# EasyEDA Pro project ThermistorFlex.eprj

# Schematic Schematic1
Board Name: Board1; Create Date: 2025-08-02; Page Name: P1; Project Name: ThermistorFlex; Schematic Name: Schematic1; Update Date: 2025-08-02; Company: EasyEDA.com; Page Size: A4; Version: V1.0
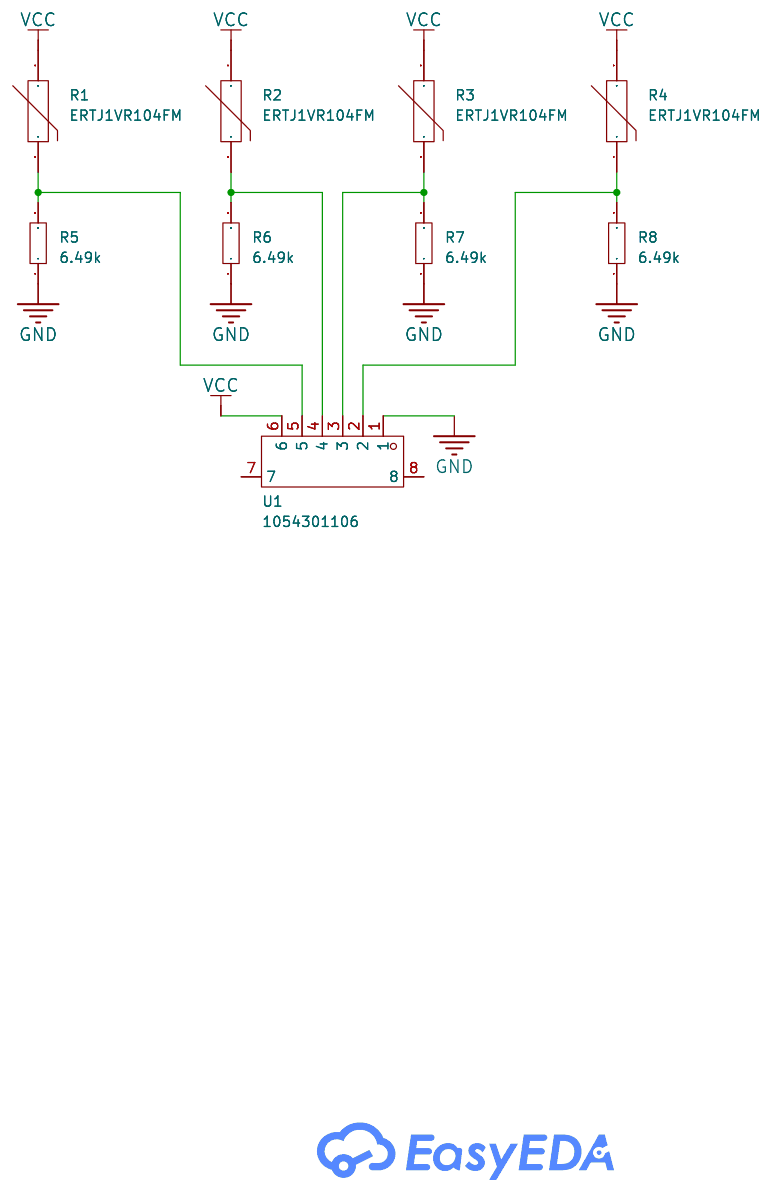
[diagram p0: schematic sheet]

## Parts
R1  ERTJ1VR104FM  [R0603]
R2  ERTJ1VR104FM  [R0603]
R3  ERTJ1VR104FM  [R0603]
R4  ERTJ1VR104FM  [R0603]
R5  6.49k  [R0603]
R6  6.49k  [R0603]
R7  6.49k  [R0603]
R8  6.49k  [R0603]
U1  1054301106  [CONN-SMD_6P-P2.50_1054301106]

## Library data of the parts
R1-R4 = ERTJ1VR104FM: Supplier Part: C336557; Manufacturer: PANASONIC(松下); Supplier Footprint: 0603; JLCPCB Part Class: Extended Part; Datasheet: https://atta.szlcsc.com/upload/public/pdf/source/20190215/C336557_EE8DBAAEED16D9BC11EE4695D1B22AA5.pdf; Supplier: LCSC; B Constant (25℃/85℃): 4250K; Operating Temperature: -40℃~+150℃
R5-R8 = Res_0603: Supplier Footprint: 0603
U1 = 1054301106: Supplier Part: C5350173; Supplier Footprint: SMD,P=2.5mm; JLCPCB Part Class: Extended Part; Supplier: LCSC

## Nets
GND: R5.1 R6.1 R7.1 R8.1 U1.1
VCC: R1.2 R2.2 R3.2 R4.2 U1.6
$1N663: R1.1 R5.2 U1.5
$1N682: R2.1 R6.2 U1.4
$1N698: R3.1 R7.2 U1.3
$1N714: R4.1 R8.2 U1.2

Not connected (* = marked no-connect by the designer): U1 7 8

# Board PCB1
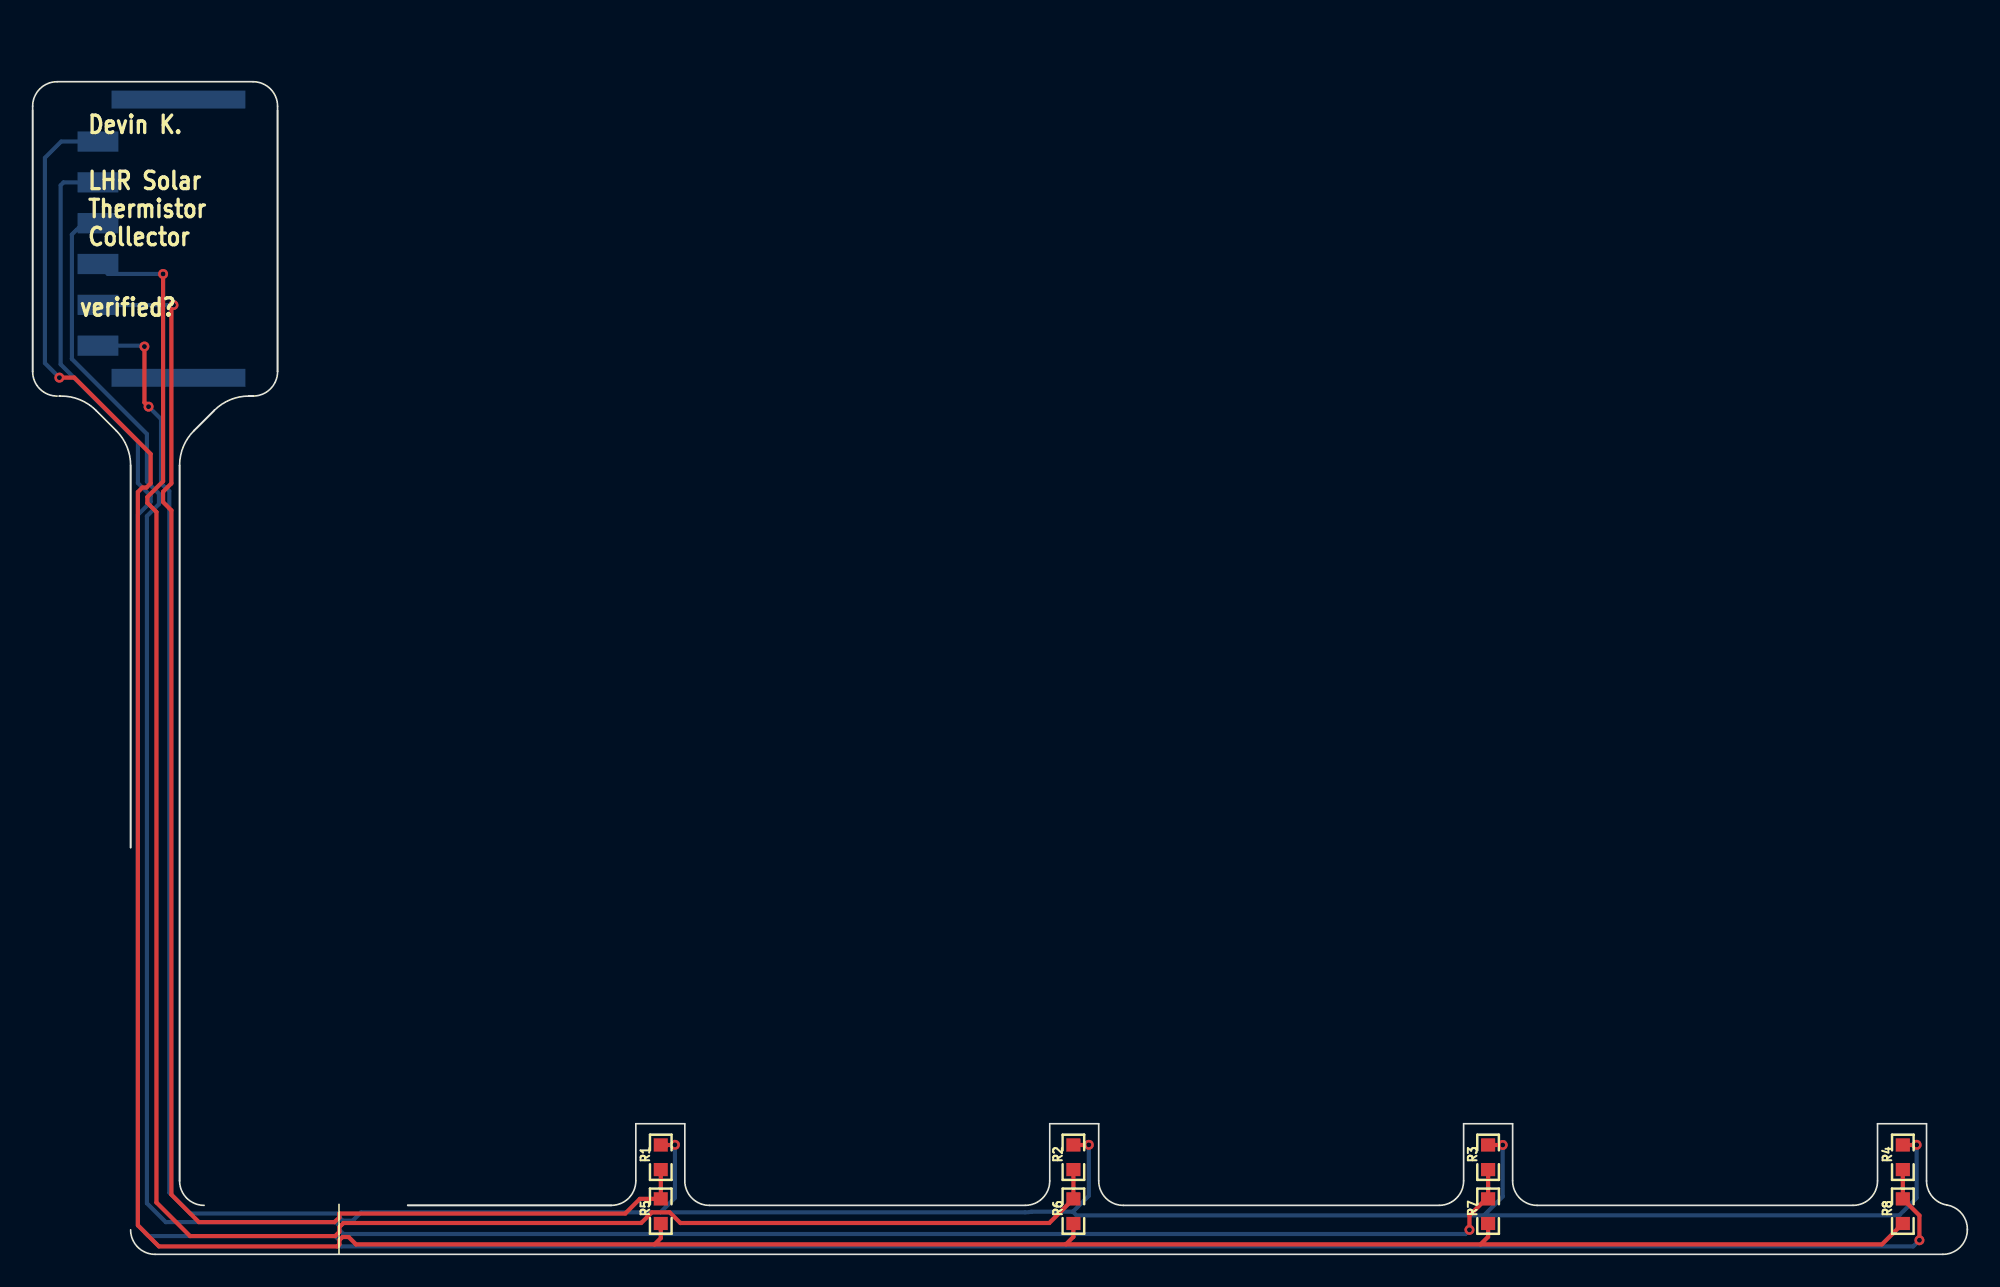
[diagram p1: board, top side]
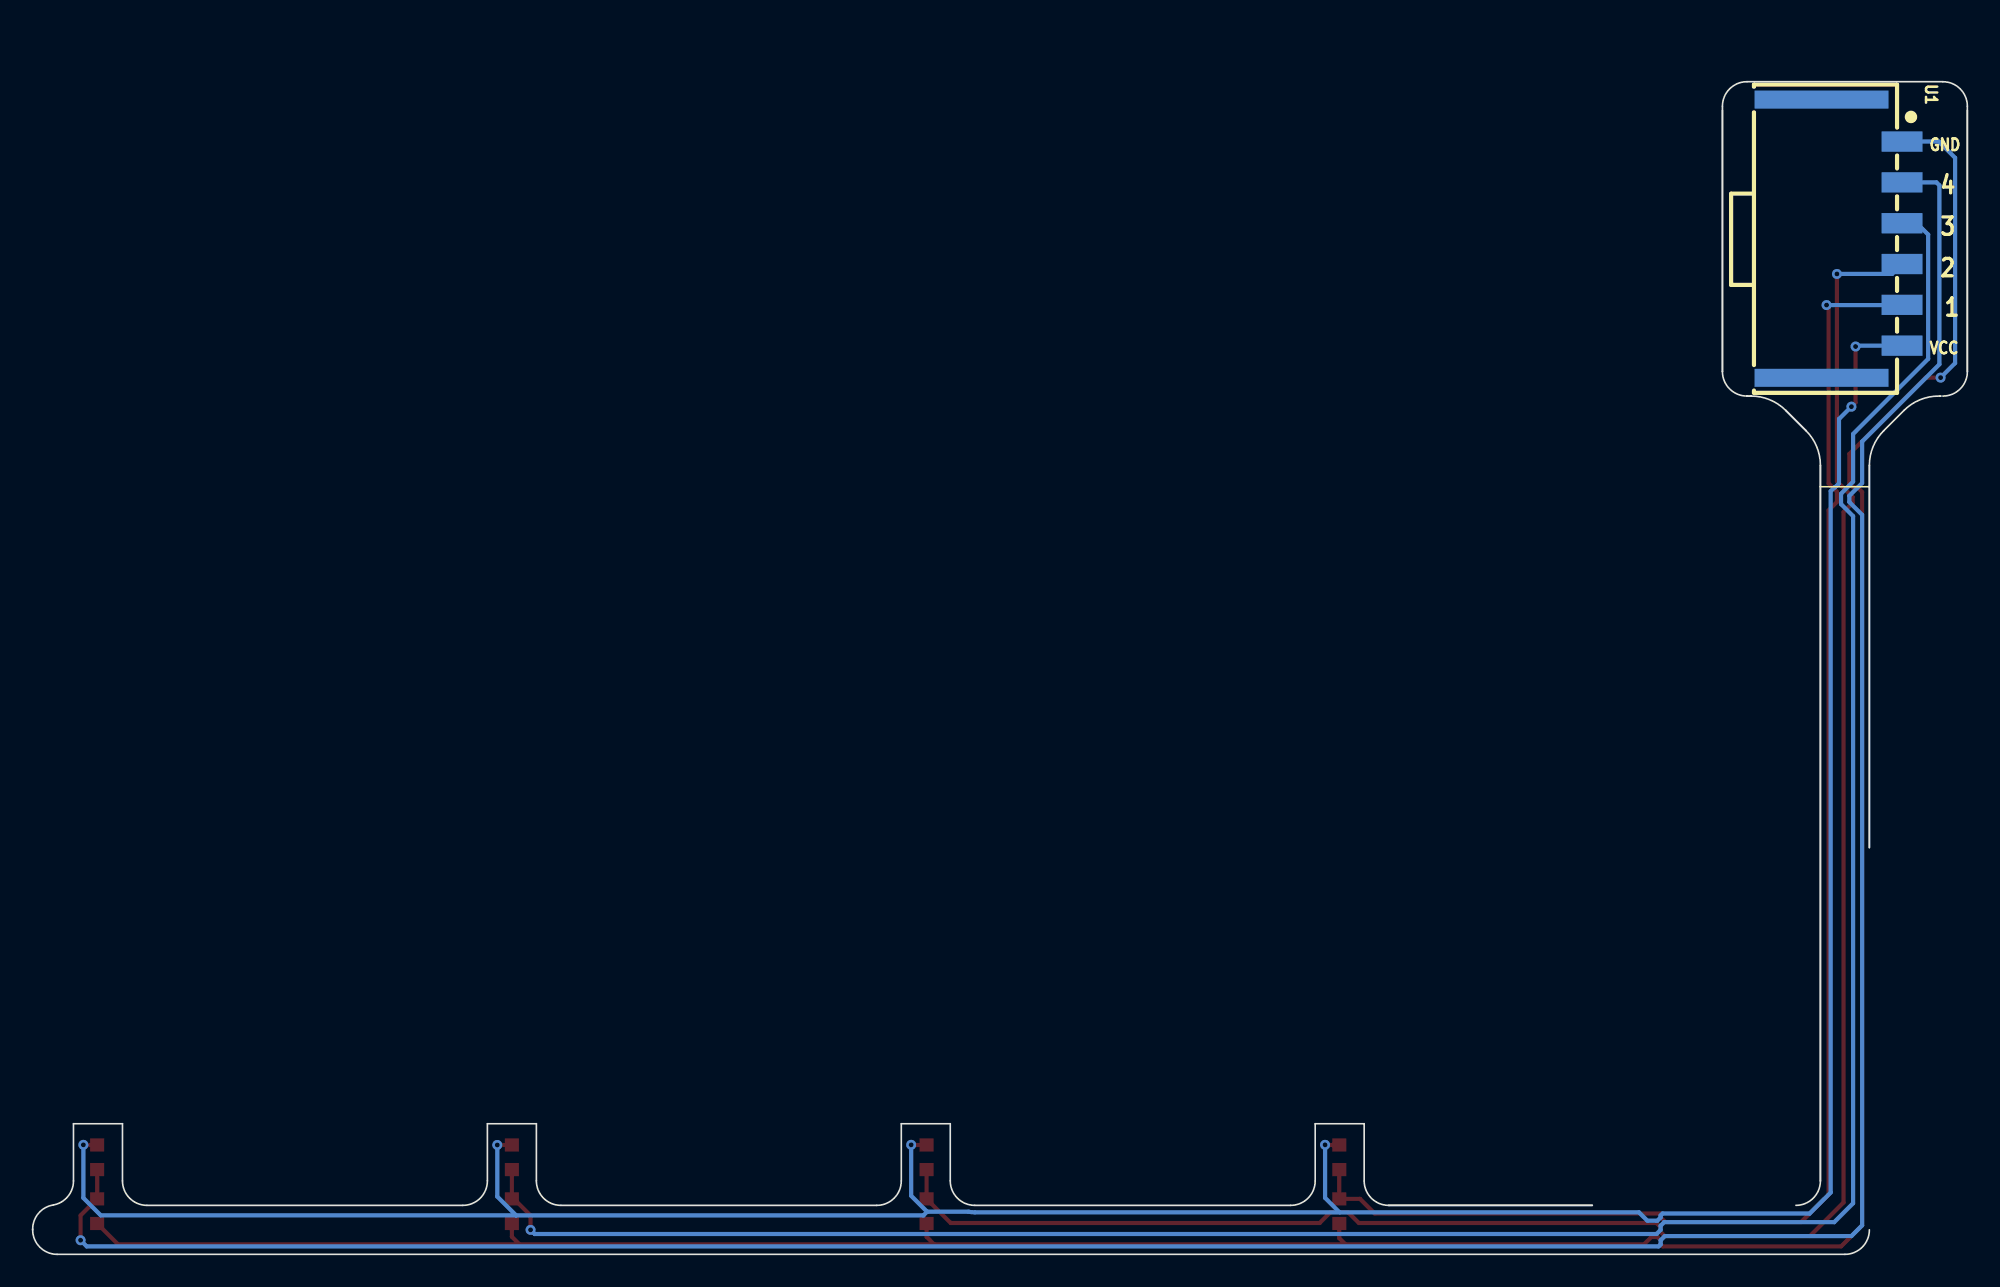
[diagram p2: board, bottom side, seen from below]

Outline 118.49 x 71.82 mm; copper layers: Top Layer, Bottom Layer. Coordinates in mm from the lower left corner of the outline.
Outline path: 0,70.07 0,54.07 ; 0,54.07 0,70.32 arc(0.44,71.38) 1.5,71.82 13.5,71.82 arc(14.56,71.38) 15,70.32 15,54.07 ; 0,54.07 arc(0.44,53.01) 1.5,52.57 ; 1.76,52.57 arc(2.91,52.34) 3.88,51.69 5.12,50.45 arc(5.77,49.47) 6,48.32 ; 6,48.32 6,24.91 6,48.32 ; 6,1.5 arc(6.44,0.44) 7.5,0 116.99,0 arc(118.05,0.44) 118.49,1.5 118.49,1.54 arc(118.14,2.51) 117.24,3.02 arc(116.35,3.53) 115.99,4.5 115.99,8 112.99,8 112.99,4.5 arc(112.55,3.44) 111.49,3 92.14,3 arc(91.08,3.44) 90.64,4.5 90.64,8 87.64,8 87.64,4.5 arc(87.2,3.44) 86.14,3 66.79,3 arc(65.73,3.44) 65.29,4.5 65.29,8 62.29,8 62.29,4.5 arc(61.85,3.44) 60.79,3 41.44,3 arc(40.38,3.44) 39.94,4.5 39.94,8 36.94,8 36.94,4.5 arc(36.5,3.44) 35.44,3 ; 9,48.32 9,4.5 ; 9,48.32 arc(9.23,49.47) 9.88,50.45 ; 9,48.32 9,4.5 ; 9,4.5 arc(9.44,3.44) 10.5,3 ; 9.88,50.45 11.12,51.69 ; 9.88,50.45 11.12,51.69 ; 11.12,51.69 arc(12.09,52.34) 13.24,52.57 ; 13.24,52.57 13.5,52.57 ; 13.24,52.57 13.5,52.57 ; 13.5,52.57 arc(14.56,53.01) 15,54.07 ; 15,54.07 15,70.07 ; 35.44,3 22.97,3 35.44,3 ; 1.63,52.57 1.69,52.57 1.63,52.57
Stack: Top Layer 0.012mm / Dielectric1 0.025mm FR4 er 4.5 / Bottom Layer 0.012mm

## Design rules (mm)
template: JLCPCB Capability(Two Layers Board)
spacing copperThickness1oz (default): track to track 0.102, other pairs 0.152 to 0.3
spacing copperThickness2oz: track to track 0.203, other pairs 0.152 to 0.3
track width copperThickness1oz (default): min 0.127, default 0.254, max 2.54
track width copperThickness2oz: min 0.203, default 0.254, max 2.54
differential pair differentialPair (default): width min 0.127, default 0.254, max 2.54; gap min 0.152, default 0.152
via viaSize (default): diameter min 0.5, default 0.61, max 10; hole min 0.3, default 0.305, max 6.3

## Placement (name value [footprint] x y rotation side)
R1  ERTJ1VR104FM  [R0603]  38.47 5.94 90 top
R2  ERTJ1VR104FM  [R0603]  63.74 5.94 90 top
R3  ERTJ1VR104FM  [R0603]  89.14 5.94 90 top
R4  ERTJ1VR104FM  [R0603]  114.54 5.94 90 top
R5  6.49k  [R0603]  38.47 2.64 90 top
R6  6.49k  [R0603]  63.74 2.64 90 top
R7  6.49k  [R0603]  89.14 2.64 90 top
R8  6.49k  [R0603]  114.54 2.64 90 top
U1  1054301106  [CONN-SMD_6P-P2.50_1054301106]  6.47 62.21 270 bottom

## Footprints (pads in the part's own frame, mm; a bottom-side part is the same pattern mirrored in y, then rotated)
CONN-SMD_6P-P2.50_1054301106
  rect 1.24x2.5 smd: 1(-5.95,2.465) 2(-3.45,2.465) 3(-0.95,2.465) 4(1.55,2.465) 5(4.05,2.465) 6(6.55,2.465)
  rect 1.1x8.2 smd: 7(8.52,-2.465) 8(-8.52,-2.465)
R0603
  rect 0.806x0.864 smd: 1(-0.753,0) 2(0.753,0)

## Nets
As in the schematic.

Pads without a net: U1 7 8

## Via types
v1: diameter 0.61, hole 0.305, Top Layer to Bottom Layer, 11 vias

## Routing (per net, layer and track width the routed paths; a pad name or vN(x,y) marks a point on that pad's centre or on a via; arc(x,y) is an arc through that point)
GND: length 186.9
  Top Layer w0.254: R5.1 38.47,0.99 38.09,0.61 ; 38.09,0.61 63.28,0.61 ; 38.09,0.61 19.8,0.61 19.35,1.06 18.98,1.06 18.78,0.87 18.78,0.61 18.66,0.49 7.73,0.49 6.44,1.77 6.44,46.69 6.72,46.97 6.97,46.97 7.23,47.22 7.23,49.02 2.55,53.7 v1(1.64,53.7) ; 63.28,0.61 63.74,1.07 R6.1 ; 63.28,0.61 88.68,0.61 ; R7.1 89.14,1.07 88.68,0.61 ; R8.1 113.26,0.61 88.68,0.61
  Bottom Layer w0.254: v1(1.64,53.7) 0.75,54.59 0.75,67.16 1.75,68.16 U1.1
VCC: length 184.5
  Top Layer w0.254: v1(115.39,6.71) 115.38,6.7 R4.2 ; v1(6.85,55.6) 6.85,52.17 v1(7.1,51.92) ; R3.2 v1(90.04,6.7) ; R1.2 39.33,6.7 v1(39.34,6.71) ; v1(64.69,6.71) 64.68,6.7 R2.2
  Bottom Layer w0.254: 88.89,2.39 114.32,2.39 115.39,3.46 v1(115.39,6.71) ; 88.89,2.39 88.88,2.39 63.94,2.39 63.71,2.61 ; 88.89,2.39 90.04,3.54 v1(90.04,6.7) ; U1.6 6.79,55.66 v1(6.85,55.6) ; v1(7.1,51.92) 7.86,51.16 7.86,47.22 8.12,46.97 8.15,46.97 8.37,46.75 8.37,3.79 9.66,2.5 18.67,2.5 18.78,2.38 18.78,2.26 18.99,2.06 19.6,2.06 20.11,2.57 38.41,2.57 ; v1(64.69,6.71) 64.69,3.59 63.71,2.61 ; 63.71,2.61 61.17,2.61 arc(60.98,2.58) 60.79,2.57 38.45,2.57 39.34,3.46 v1(39.34,6.71)
$1N663: length 92.8
  Top Layer w0.254: R1.1 R5.2 37.19,3.4 36.29,2.5 18.78,2.5 18.78,2.25 18.48,1.97 10.18,1.97 8.5,3.66 8.5,45.57 7.99,46.08 7.99,46.71 8.5,47.22 8.5,58.01 v1(8.62,58.14)
  Bottom Layer w0.254: v1(8.62,58.14) 4.01,58.14 U1.5
$1N682: length 122.2
  Top Layer w0.254: v1(7.99,60.05) 7.99,47.35 7.03,46.38 7.03,46.02 7.58,45.47 7.58,3.18 9.64,1.12 18.53,1.12 18.78,1.37 18.78,1.67 19.04,1.92 37.27,1.92 37.92,2.57 39.02,2.57 39.67,1.92 62.27,1.92 R6.2 R2.1
  Bottom Layer w0.254: U1.4 4.61,60.05 v1(7.99,60.05)
$1N698: length 150
  Top Layer w0.254: R3.1 R7.2 89.02,3.4 88,2.38 v1(88,1.5)
  Bottom Layer w0.254: U1.3 3.1,63.16 2.4,62.46 2.4,54.84 7,50.24 7,47.32 7.73,46.58 7.73,45.95 7,45.21 7,3.13 8.15,1.97 18.57,1.97 18.78,1.75 18.78,1.5 19.04,1.25 87.75,1.25 v1(88,1.5)
$1N714: length 183.4
  Top Layer w0.254: v1(115.56,0.86) 115.56,2.38 R8.2 R4.1
  Bottom Layer w0.254: v1(115.56,0.86) 115.18,0.49 18.91,0.49 18.78,0.61 18.78,0.86 18.53,1.12 7.1,1.12 6.44,1.77 6.44,45.29 7.23,46.08 7.23,46.46 6.44,47.24 6.44,49.78 1.71,54.51 1.71,65.48 1.89,65.66 U1.2

## Text on the board
Bottom Silkscreen Layer: GND | VCC | 1 | 4 | 3 | 2
Top Silkscreen Layer: verified? | Devin K. / LHR Solar / Thermistor / Collector
